# Altium schematic sheet Sheet1.SchDoc
size A
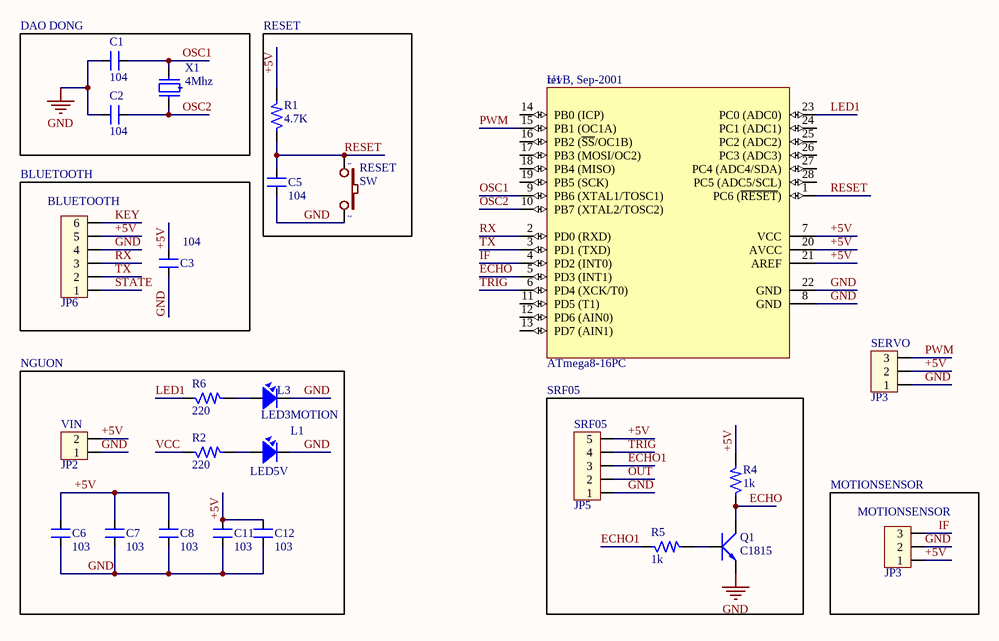
[diagram p0: Sheet1.SchDoc]

## Parts
BLUETOOTH  JP6  [CON6]
C1  104  [SM-0805]
C2  104  [SM-0805]
C3  104  [SM-0805]
C5  104  [SM-0805]
C6  103  [SM-0805]
C7  103  [SM-0805]
C8  103  [SM-0805]
C11  103  [SM-0805]
C12  103  [SM-0805]
L1  LED5V  [LED-3]
L3  LED3MOTION  [LED-3]
MOTIONSENSOR  JP3  [CON3]
Q1  C1815  [QTO-92]
R1  4.7K  [SM-0805]
R2  220  [SM-0805]
R4  1k  [SM-0805]
R5  1k  [SM-0805]
R6  220  [SM-0805]
RESET  SW  [SW2]
SERVO  JP3  [CON3]
SRF05  JP5  [CON5]
U1  ATmega8-16PC  PackageVersion: revB, Sep-2001  [28P3]
VIN  JP2  [CON2]
X1  4Mhz  [XT2]

## Blocks framed on the sheet
DAO DONG: C1 C2 X1
RESET: C5 R1 RESET
BLUETOOTH: BLUETOOTH C3
NGUON: C6-C8 C11 C12 L1 L3 R2 R6 VIN
SRF05: Q1 R4 R5 SRF05
MOTIONSENSOR: MOTIONSENSOR

## Nets
GND: BLUETOOTH.4 C1.1 C2.1 C3.1 C5.1 C6.1 C7.1 C8.1 C11.1 C12.1 L1.2 L3.2 MOTIONSENSOR.2 Q1.1(E) RESET.2 SERVO.1 SRF05.1 U1.8(GND) U1.22(GND) VIN.1
+5V: BLUETOOTH.5 C3.2 C6.2 C7.2 C8.2 C11.2 C12.2 MOTIONSENSOR.1 R1.2 R4.2 SERVO.2 SRF05.5 U1.7(VCC) U1.20(AVCC) U1.21(AREF) VIN.2
ECHO: Q1.2(C) R4.1 U1.5(PD3_(INT1))
ECHO1: R5.1 SRF05.3
IF: MOTIONSENSOR.3 U1.4(PD2_(INT0))
KEY: BLUETOOTH.6
LED1: R6.1 U1.23(PC0_(ADC0))
OSC1: C1.2 U1.9(PB6_(XTAL1/TOSC1)) X1.2
OSC2: C2.2 U1.10(PB7_(XTAL2/TOSC2)) X1.1
OUT: SRF05.2
PWM: SERVO.3 U1.15(PB1_(OC1A))
RESET: C5.2 R1.1 RESET.1 U1.1(PC6_(~{RESET}))
RX: BLUETOOTH.3 U1.2(PD0_(RXD))
STATE: BLUETOOTH.1
TRIG: SRF05.4 U1.6(PD4_(XCK/T0))
TX: BLUETOOTH.2 U1.3(PD1_(TXD))
VCC: R2.1
NetL1_1: L1.1 R2.2
NetL3_1: L3.1 R6.2
NetQ1_3: Q1.3(B) R5.2

Not connected (* = marked no-connect by the designer): U1 11(PD5_(T1)) 12(PD6_(AIN0)) 13(PD7_(AIN1)) 14(PB0_(ICP)) 16(PB2_(~{SS}/OC1B)) 17(PB3_(MOSI/OC2)) 18(PB4_(MISO)) 19(PB5_(SCK)) 24(PC1_(ADC1)) 25(PC2_(ADC2)) 26(PC3_(ADC3)) 27(PC4_(ADC4/SDA)) 28(PC5_(ADC5/SCL)); X1 3

## Library data of the parts
BLUETOOTH = Con6: Connector 6; Value: Connector 6
C1-C3 C5 = CM: Cap SMD; Value: 103
C6-C8 C11 C12 = CM: Cap SMD; Value: 103
L1 L3 = LED: LED Single colour Green and Red; Value: LED 3 ly Single Colour
MOTIONSENSOR SERVO = Con3: Connector 3; Value: Connector 3
Q1 = C1815: NPN 600mW, ECB; Value: C1815
R1 R2 R4-R6 = R: Resistor 1/4W; Value: R1/4W - 1K
RESET = SW2: Switch button 2 pin; Value: SW chip 2 pin
SRF05 = Con5: Connector 5; Value: Connector 5
U1 = ATmega8-16PC: 8-Bit AVR Microcontroller with 8K Bytes of In-System Programmable Flash Memory; Published: 17-Sep-2003; DatasheetVersion: 2486H-AVR-09/02; PackageReference: 28P3; Publisher: Altium Limited; PackageDescription: 28-lead (0.300"/7.62mm Wide) Plastic Dual Inline Package (PDIP); Supplier 1: Digi-Key; Supplier Part Number 1: ATMEGA8-16PC-ND; Supplier 2: Mouser; Supplier Part Number 2: 556-ATMEGA8-16PC; ComponentLink1Description: Datasheet; ComponentLink1URL: http://www.atmel.com/dyn/resources/prod_documents/doc2486.pdf; ComponentLink2Description: Atmel.com Home; ComponentLink2URL: http://www.atmel.com
VIN = Con2: Connector 2; Value: Connector 2
X1 = XT3: Crystal For all Crystal 2pin.; Value: 4Mhz